# Altium project my_final_project.PrjPcb
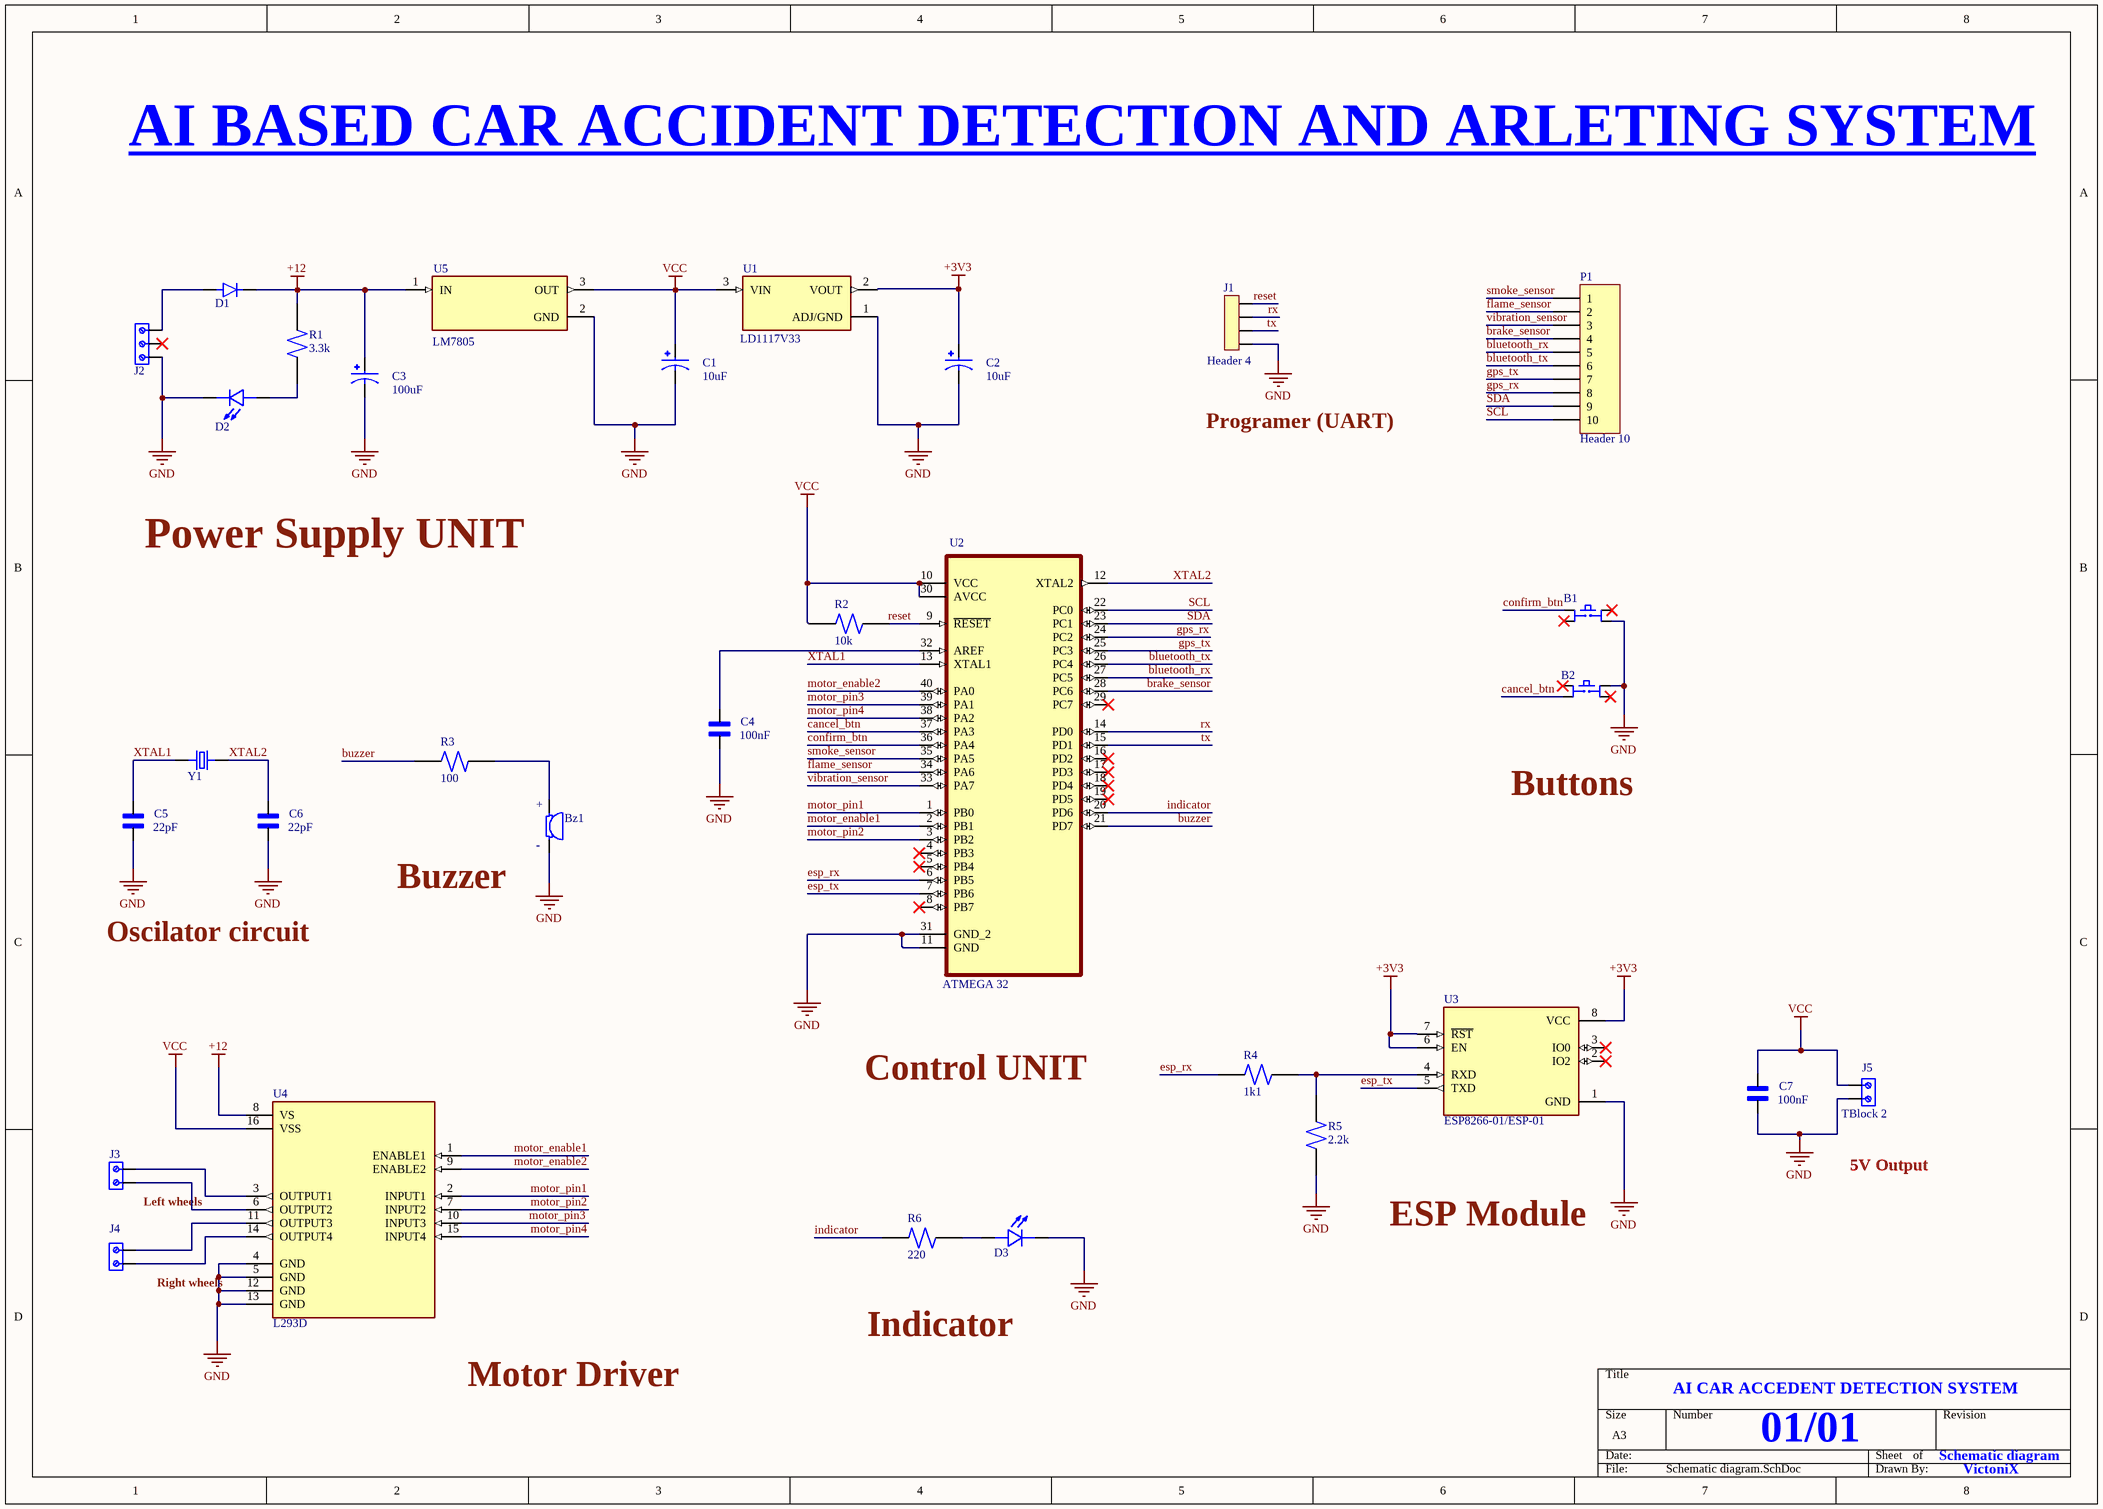
[diagram p0: Schematic diagram.SchDoc]
1 sheet, 31 parts. Net scope: global (net labels, ports and power ports of the same name join across sheets).
Board file: PCB_layout.PcbDoc

## Sheet Schematic diagram.SchDoc
size A3; SheetNumber: 1; SheetTotal: 1

### Parts
B1  Push button  [SW_TS02-66-95-BK-260-LCR-D]  (value not drawn)
B2  Push button  [SW_TS02-66-95-BK-260-LCR-D]  (value not drawn)
Bz1  AI-1223-TWT-12V-R  [XDCR_AI-1223-TWT-12V-R]  (value not drawn)
C1  10uF  [CAPPRD500W50D500H1100]
C2  10uF  [CAPPRD500W50D500H1100]
C3  100uF  [CAPPRD500W50D500H1100]
C4  100nF  [CAPRB500W50L450T300H550]
C5  22pF  [CAPRB500W50L450T300H550]
C6  22pF  [CAPRB500W50L450T300H550]
C7  100nF  [CAPRB500W50L450T300H550]
D1  1N4007  [DIOAD1060W70L435D230]  (value not drawn)
D2  L08R5000Q1  [LEDRD254W57D500H1070]  (value not drawn)
D3  L08R5000Q1  [LEDRD254W57D500H1070]  (value not drawn)
J1  Header 4  [SULLINS_PPTC041LFBN-RC]
J2  691214110003  [691214110003]  (value not drawn)
J3  691111710002  [691111710002]  (value not drawn)
J4  691111710002  [691111710002]  (value not drawn)
J5  TBlock 2  [691111710002]
P1  Header 10  [HDR1X10]
R1  3.3k  [RESAD1100W55L680D260]
R2  10k  [RESAD1100W55L680D260]
R3  100  [RESAD1100W55L680D260]
R4  1k1  [RESAD1100W55L680D260]
R5  2.2k  [RESAD1100W55L680D260]
R6  220  [RESAD1100W55L680D260]
U1  LD1117V33  [TO255P1020X450X1968-3]
U2  ATMEGA 32  [DIP254P1524X482-40]
U3  ESP8266-01/ESP-01  [XCVR_ESP8266-01/ESP-01]
U4  L293D  [DIP880W50P254L2000H510Q16]
U5  LM7805  [TO254P1054X470X1955-3]
Y1  ECS-160-S-4  [XTAL_ECS-160-20-4X]  (value not drawn)

### Nets
+3V3: C2.P U1.2(VOUT) U3.6(EN) U3.7(~{RST}) U3.8(VCC)
+12: C3.P D1.C R1.2 U4.8(VS) U5.1(IN)
GND: B1.4 B2.3 Bz1.N(NEG) C1.N C2.N C3.N C4.1 C5.1 C6.1 C7.1 D2.C D3.C J1.4 J2.1 J5.2 R5.1 U1.1(ADJ/GND) U2.11(GND) U2.31(GND_2) U3.1(GND) U4.4(GND) U4.5(GND) U4.12(GND) U4.13(GND) U5.2(GND)
VCC: C1.P C7.2 J5.1 R2.2 U1.3(VIN) U2.10(VCC) U2.30(AVCC) U4.16(VSS) U5.3(OUT)
bluetooth_rx: P1.5 U2.27(PC5)
bluetooth_tx: P1.6 U2.26(PC4)
brake_sensor: P1.4 U2.28(PC6)
buzzer: R3.2 U2.21(PD7)
cancel_btn: B2.2 U2.37(PA3)
confirm_btn: B1.1 U2.36(PA4)
esp_rx: R4.2 U2.6(PB5)
esp_tx: U2.7(PB6) U3.5(TXD)
flame_sensor: P1.2 U2.34(PA6)
gps_rx: P1.8 U2.24(PC2)
gps_tx: P1.7 U2.25(PC3)
indicator: R6.2 U2.20(PD6)
motor_enable1: U2.2(PB1) U4.1(ENABLE1)
motor_enable2: U2.40(PA0) U4.9(ENABLE2)
motor_pin1: U2.1(PB0) U4.2(INPUT1)
motor_pin2: U2.3(PB2) U4.7(INPUT2)
motor_pin3: U2.39(PA1) U4.10(INPUT3)
motor_pin4: U2.38(PA2) U4.15(INPUT4)
reset: J1.1 R2.1 U2.9(~{RESET})
rx: J1.2 U2.14(PD0)
SCL: P1.10 U2.22(PC0)
SDA: P1.9 U2.23(PC1)
smoke_sensor: P1.1 U2.35(PA5)
tx: J1.3 U2.15(PD1)
vibration_sensor: P1.3 U2.33(PA7)
XTAL1: C5.2 U2.13(XTAL1) Y1.1
XTAL2: C6.2 U2.12(XTAL2) Y1.2
NetBz1_P: Bz1.P(POS) R3.1
NetC4_2: C4.2 U2.32(AREF)
NetD1_A: D1.A J2.3
NetD2_A: D2.A R1.1
NetD3_A: D3.A R6.1
NetJ3_1: J3.1 U4.3(OUTPUT1)
NetJ3_2: J3.2 U4.6(OUTPUT2)
NetJ4_1: J4.1 U4.11(OUTPUT3)
NetJ4_2: J4.2 U4.14(OUTPUT4)
NetR4_1: R4.1 R5.2 U3.4(RXD)

Not connected (* = marked no-connect by the designer): B1 2* 3*; B2 1* 4*; J2 2*; U2 4(PB3)* 5(PB4)* 8(PB7)* 16(PD2)* 17(PD3)* 18(PD4)* 19(PD5)* 29(PC7)*; U3 2(IO2)* 3(IO0)*

### Notes on the sheet
- AI BASED CAR ACCIDENT DETECTION AND ARLETING SYSTEM
- Programer (UART)
- Power Supply UNIT
- Buttons
- (near Bz1) Buzzer
- Oscilator circuit
- Control UNIT
- 5V Output
- (near J3) Left wheels
- ESP Module
- (near J4) Right wheels
- (near U4) Motor Driver
- Indicator
- AI CAR ACCEDENT DETECTION SYSTEM
- 01/01
- Schematic diagram
- VictoniX
- (in symbol Buzzer) +; -

### Library data of the parts
Bz1 = Buzzer: ELECTRO-MECHANICAL AUDIO INDICATOR; MF: PUI Audio,; Availability: In Stock; Package: 2225 PUI Audio; Value: *; Price: None; MP: AI-1223-TWT-12V-R; Purchase-URL: https://pricing.snapeda.com/search/part/AI-1223-TWT-12V-R/?ref=eda
C1-C3 = Electrolytic capacitor: FS-A; MF: {'manufacturer': u'Panasonic'}; MP: EEUFS0J221B; Package: None; Value: *; Availability: Unavailable; Price: None
C4-C7 = Ceramic capacitor: 2200 pF Â±10% 250V Ceramic Capacitor X7R Radial; MF: TDK; MP: FG24X7R2E222KNT06; Digi-Key_Part_Number: 445-173386-1-ND; Purchase-URL: https://pricing.snapeda.com/search/part/FG24X7R2E222KNT06/?ref=eda; Check_prices: https://www.snapeda.com/parts/FG24X7R2E222KNT06/TDK/view-part/?ref=eda; Value: *; Package: Radial TDK; SnapEDA_Link: https://www.snapeda.com/parts/FG24X7R2E222KNT06/TDK/view-part/?ref=snap
D1 = Diode: Diode Switching 1KV 1A 2-Pin DO-41; Price: None; MP: 1N4007; Value: *; Availability: Unavailable; Package: None
D2 D3 = LED: LED, Orange, Through Hole, T-1 3/4 (5mm), 30 mA, 2.1 V, 635 nm; MF: {'manufacturer': u'LED Technology'}; Price: None; Package: None; Availability: Unavailable; MP: L08R5000Q1; Value: *
J1 = Female header - 4Pins: 4 Position Header Connector Through Hole; MP: PPTC041LFBN-RC; MF: Sullins Connector; Value: *; SnapEDA_Link: https://www.snapeda.com/parts/PPTC041LFBN-RC/Sullins%20Connector%20Solutions/view-part/285917/?ref=snap; Package: None; Availability: Warning; Check_prices: https://www.snapeda.com/parts/PPTC041LFBN-RC/Sullins%20Connector%20Solutions/view-part/285917/?ref=eda; Price: None; Purchase-URL: https://pricing.snapeda.com/search/part/PPTC041LFBN-RC/?ref=eda
J2 = Terminal blocks - 3Pins (Small): 3 Position Wire to Board Terminal Block Horizontal with Board 0.138 (3.50mm) Through Hole; MF: Wurth Elektronik; Price: None; SnapEDA_Link: https://www.snapeda.com/parts/691214110003/Wurth+Elektronik/view-part/?ref=snap; Purchase-URL: https://pricing.snapeda.com/search/part/691214110003/?ref=eda; Availability: In Stock; MP: 691214110003; Package: None; Check_prices: https://www.snapeda.com/parts/691214110003/Wurth+Elektronik/view-part/?ref=eda; Value: *
J3-J5 = Terminal Block - 2Pins: 2 Position Wire to Board Terminal Block Horizontal with Board 0.197 _5.00mm_ Through Hole; MF: Wurth Electronics; Value: *; Availability: Unavailable; MP: 691111710002; Price: None; Package: None; SnapEDA_Link: https://www.snapeda.com/parts/691111710002/Wurth%20Electronics%20Inc./view-part/1195092/?ref=snap
P1 = Header 10: Header, 10-Pin; LatestRevisionDate: 17-Jul-2002; LatestRevisionNote: Re-released for DXP Platform.; Publisher: Altium Limited
R1-R6 = Resistor (0.25W): (MFR-25FBF52-10K) 10,2 kOhm bei 1% 0,25W, 1/4W Durchbohrlochwiderstand Axial Metal Film; MF: Yageo; Digi-Key_Part_Number: 10.2KXBK-ND; SnapEDA_Link: https://www.snapeda.com/parts/MFR-25FBF52-10K/Yageo/view-part/424333/?ref=snap; Package: Axial Yageo; Purchase-URL: https://pricing.snapeda.com/search/part/MFR-25FBF52-10K/?ref=eda; MP: MFR-25FBF52-10K; Value: *
U2 = ATMEGA16A-PU: AVR AVRÂ® ATmega Microcontroller IC 8-Bit 16MHz 16KB _8K x 16_ FLASH 40-PDIP; MF: Microchip; Price: None; Availability: Unavailable; Package: PDIP-40 Microchip; SnapEDA_Link: https://www.snapeda.com/parts/ATMEGA16A-PU/Microchip/view-part/618034/?ref=snap; MP: ATMEGA16A-PU; Value: *
U3 = ESP8266-01 Module: MakerFocus 4pcs ESP8266 ESP-01 Serial Wireless WiFi Transceiver Receiver Module 1MB SPI Flash DC3.0-3.6V Internet of Things WiFi Module Board Compatible with Ar duino; Value: *; MP: ESP8266-01/ESP-01; Package: None; Availability: Unavailable; Price: None
U4 = L293D: 4-Channel Motor Driver 24V 16-Pin Power PDIP Tube; Price: None; Package: None; Availability: Unavailable; MP: L293D; Value: *
U5 = LM7805: MP: LM7805CT/NOPB; Price: None; Value: *; Availability: Unavailable; Package: None
Y1 = Crystal oscilator: CRYSTAL T/H; MF: {'manufacturer': u'ECS Inc.'}; Package: None; Value: *; MP: ECS-160-S-4; Availability: Unavailable; Price: None
U1 = LD1117V33: Package: None; MP: LD1117V33; Price: None; Availability: Unavailable; Value: *